# EAGLE design tachometer (EAGLE 5.12)
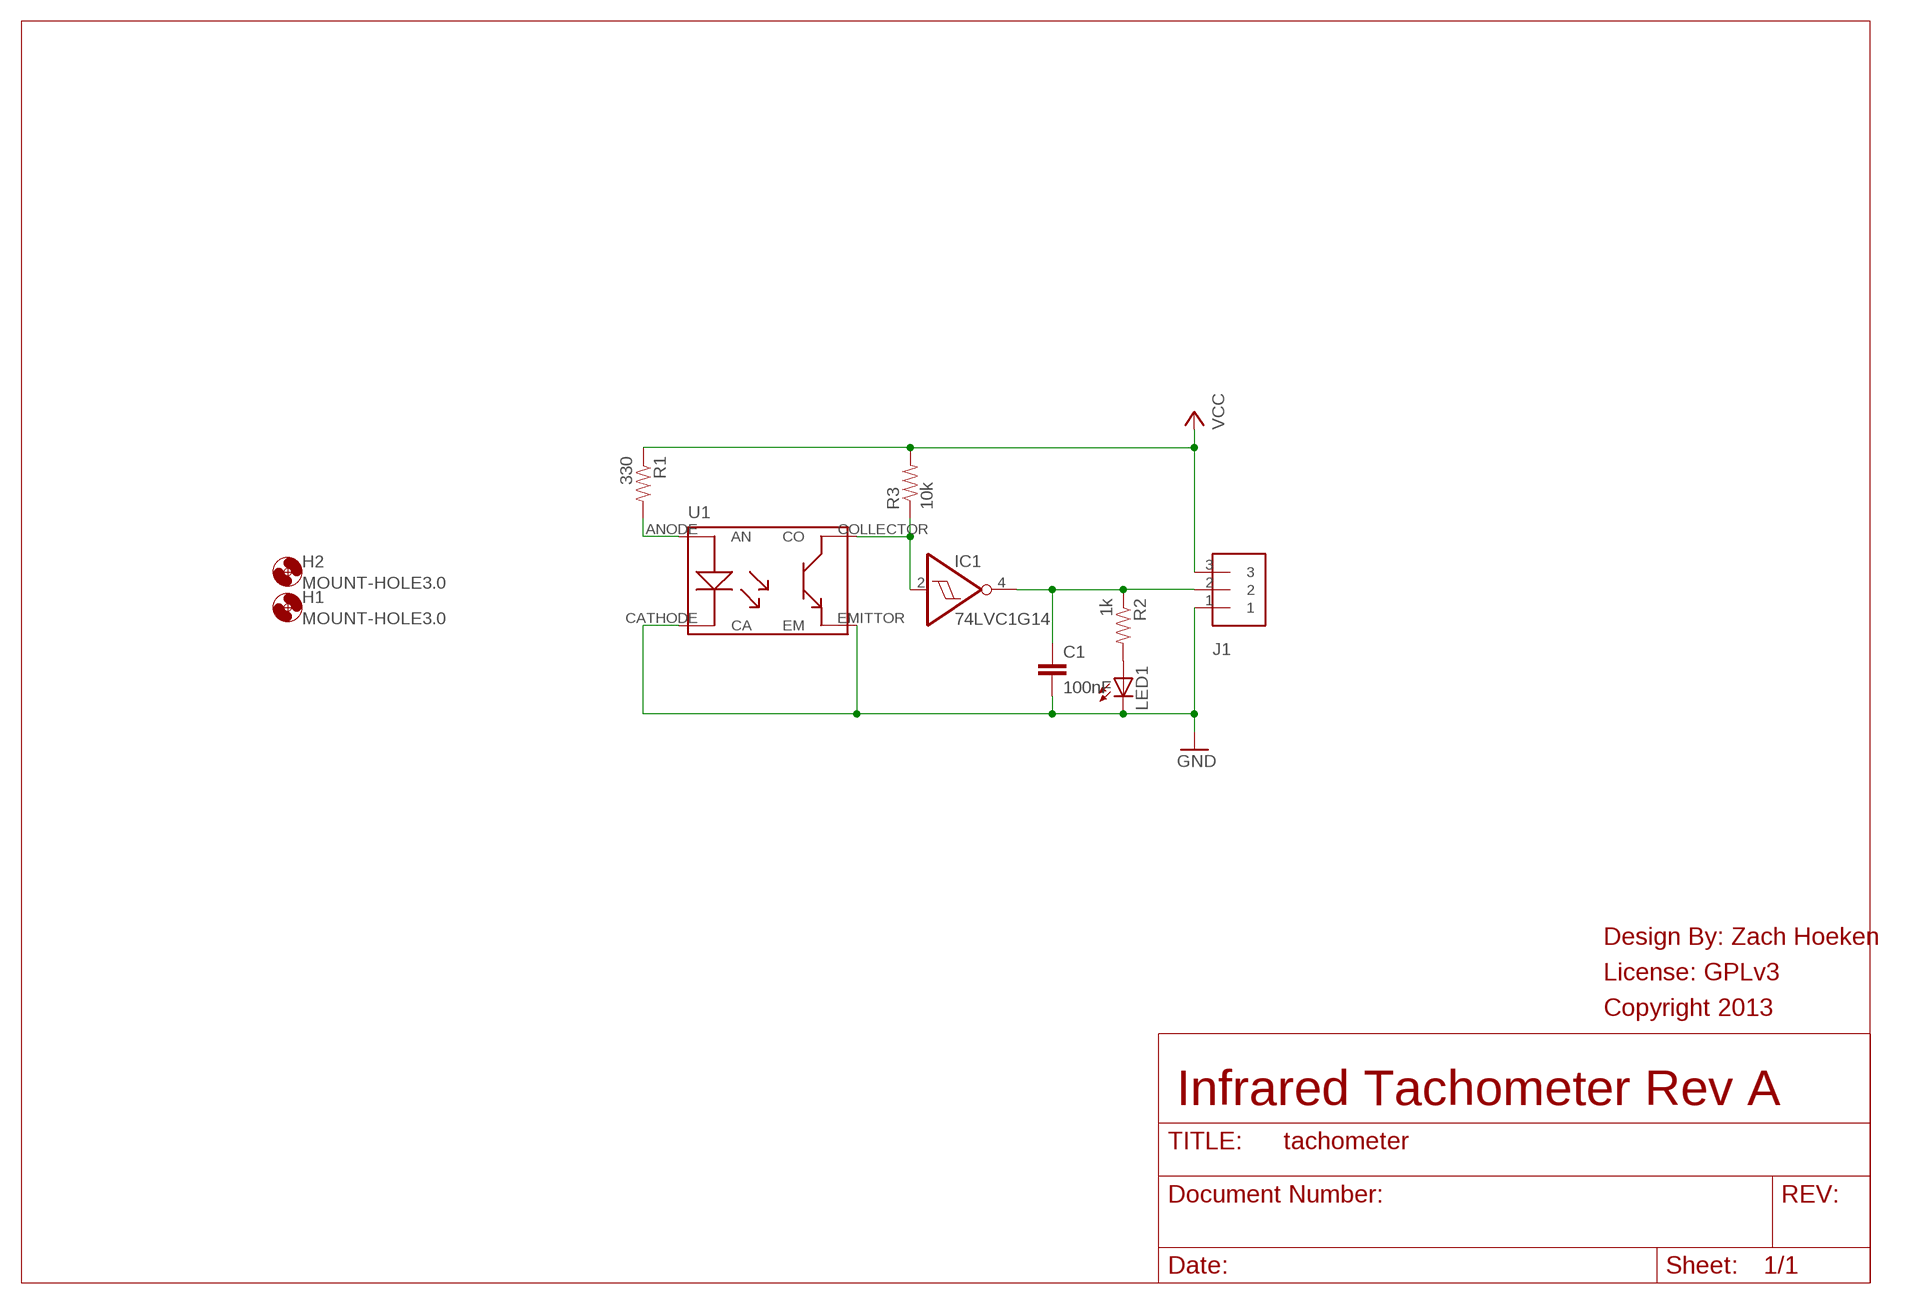
[diagram p0: schematic, sheet 1]

## Parts
C1  100nF  CAPACITOR0603  [0603-RC]
H1  MOUNT-HOLE3.0  [3,0]
H2  MOUNT-HOLE3.0  [3,0]
IC1  74LVC1G14  74AHC1G14DBV  [SOT23-5]
J1  CONN-3XH-3-RA  [XH-3-RA]
LED1  LED0805  [0805-LED]
R1  330  RESISTOR0603  [0603-RC]
R2  1k  RESISTOR0805  [0805-RC]
R3  10k  RESISTOR0603  [0603-RC]
U1  TCRT5000  [TCRT5000]

## Nets
GND: C1.2 J1.1 LED1.C U1.CATHODE(CA) U1.EMITTOR(EM)
N$1: IC1.2(I) R3.1 U1.COLLECTOR(CO)
N$2: R1.2 U1.ANODE(AN)
N$4: C1.1 IC1.4(O) J1.2 R2.1
N$5: LED1.A R2.2
VCC: J1.3 R1.1 R3.2

## Notes on the sheet
- Design By: Zach Hoeken
- License: GPLv3
- Copyright 2013
- Infrared Tachometer Rev A

## Power pins joined to a net without a drawn wire
GND: IC1.3(GND)
VCC: IC1.5(VCC)

## Library data of the parts
C1 = Hoektronics:CAPACITOR: Capacitor Standard 0603 ceramic capacitor, and 0.1" leaded capacitor.
H1 H2 = holes:MOUNT-HOLE: MOUNTING HOLE with drill center marker
IC1 = 74xx-little-de:74*1G14: Single Schmitt-Trigger Inverter Gate
J1 = Hoektronics:CONN-3
LED1 = Hoektronics:LED: LEDs Standard schematic elements and footprints for 5mm, 3mm, 1206, and 0603 sized LEDs. 5mm - Spark Fun Electronics SKU : COM-00529 (and others)
R1-R3 = Hoektronics:RESISTOR: Resistor Basic schematic elements and footprints for 0603, 1206, and PTH 1/10th watt (small) resistors.
U1 = Hoektronics:TCRT5000

## Net classes
0 default: width 0.203 mm, clearance 0.305 mm

## Board
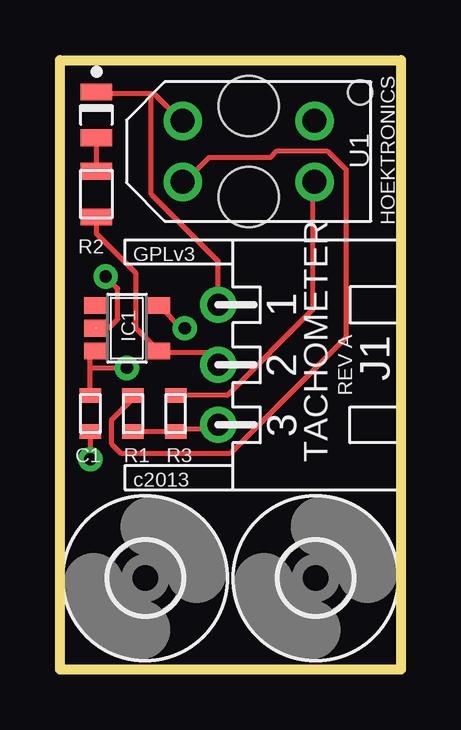
[diagram p1: board, top side]
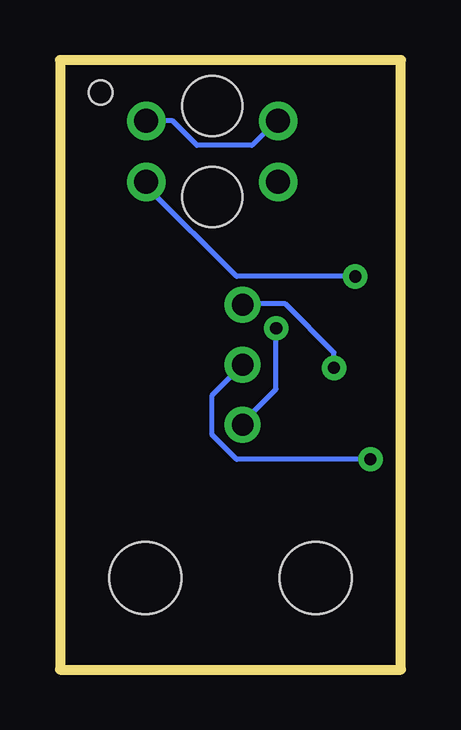
[diagram p2: board, bottom side, seen from below]

Size 14.22 x 25.4 mm. Coordinates in mm from the lower left corner, seen from the top.
Outline: 0,0 0,25.4 14.22,25.4 14.22,0 0,0
Copper layers (1*16): Top 0.035mm / dielectric 1.5mm / Bottom 0.035mm
Design rules "hoektronics": minimum track width 8mil, minimum drill 20mil, track to track 8mil, track to pad 8mil, pad to pad 8mil, via to via 8mil, smd to smd 8mil, copper to edge 10mil, drill to drill 8mil, minimum pad ring 12mil, minimum via ring 10mil, stop-mask expansion 4mil, vias tented up to drill 25mil, thermal gap 10mil

### Footprints (pad centres in the part's own frame; a part is rotated, then mirrored left to right if it is on the bottom)
0603-RC = smd 0.6 x 0.9: 1 -0.75,0; 2 0.75,0
3,0 = hole 3: 0,0
SOT23-5 = smd 0.69 x 0.99: 1 -0.95,-1.29; 2 0,-1.29; 3 0.95,-1.29; 4 0.95,1.3; 5 -0.95,1.3
XH-3-RA = drill 0.9 round: 1 -2.5,0; 2 0,0; 3 2.5,0
0805-LED = smd 0.7 x 1.3: A 0.95,0; C -0.95,0
0805-RC = smd 0.7 x 1.3: 1 -0.95,0; 2 0.95,0
TCRT5000 = drill 1 round: ANODE 2.75,1.27; CATHODE 2.75,-1.27; COLLECTOR -2.75,1.27; EMITTOR -2.75,-1.27 | hole 2.5: 0,1.9; 0,-1.9 | hole 1: -4.65,-2.45

### Placement (x,y rotation side)
C1  1.27,10.67 90 top
H1  3.56,3.81 180 top
H2  10.67,3.81 180 top
IC1  2.79,14.22 270 top
J1  6.6,12.7 270 top
LED1  1.52,23.11 270 top
R1  3.05,10.67 90 top
R2  1.52,19.81 90 top
R3  4.83,10.67 270 top
U1  7.87,21.59 180 top

### Tracks (layer width: path | path; a pad name or v marks a point on that pad's centre or on a via)
GND  (via drill 0.51)
  Top 0.203: 1.27,12.57 1.27,13.08 1.4,13.21 IC1.3 | C1.2 1.27,12.57 | 1.27,12.57 v2.79,12.57 | 3.81,24 3.94,24 5.08,22.86 U1.CATHODE | 3.81,24 1.52,24 LED1.C | 3.81,24 3.81,19.81 6.6,17.02 J1.1
  Bottom 0.203: v2.79,12.57 2.79,13.21 4.83,15.24 6.6,15.24 J1.1 | U1.EMITTOR 9.53,22.86 8.51,21.84 6.22,21.84 5.21,22.86 U1.CATHODE
N$1  (via drill 0.51)
  Top 0.203: R3.1 6.99,11.43 10.54,14.99 10.54,20.32 U1.COLLECTOR | v1.91,16.38 2.41,15.88 2.41,14.61 2.03,14.22 IC1.2
  Bottom 0.203: v1.91,16.38 6.86,16.38 10.54,20.07 10.54,20.32 U1.COLLECTOR
N$2
  Top 0.203: R1.2 3.05,11.3 2.16,10.41 2.16,9.4 2.54,9.02 7.11,9.02 11.94,13.84 11.94,20.83 11.18,21.59 9.02,21.59 8.76,21.34 6.22,21.34 5.21,20.32 U1.ANODE
N$4  (via drill 0.51)
  Top 0.203: C1.1 v1.27,8.76 | J1.2 6.1,13.21 4.19,13.21 IC1.4 4.06,13.34 3.17,14.22 3.17,16.51 1.52,18.16 R2.1
  Bottom 0.203: v1.27,8.76 6.86,8.76 7.87,9.78 7.87,11.43 J1.2
N$5
  Top 0.203: R2.2 LED1.A
VCC  (via drill 0.51)
  Top 0.203: R1.1 3.05,9.91 4.83,9.91 R3.2 4.83,10.03 6.48,10.03 6.6,10.16 J1.3 | v5.21,14.22 5.08,14.22 4.19,15.11 IC1.5
  Bottom 0.203: v5.21,14.22 5.21,11.68 6.6,10.29 J1.3

### Text on the board
tPlace: HOEKTRONICS | GPLv3 | REV A | TACHOMETER | c2013